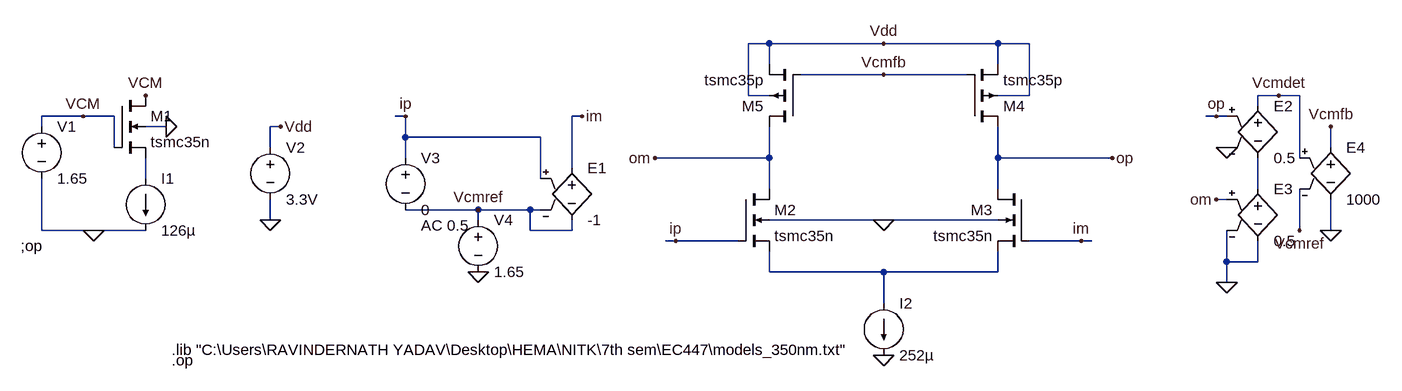
[diagram p0: schematic gm_macro.asc]
gm_macro.asc, the LTspice schematic file:
Version 4
SHEET 1 2024 680
WIRE 1072 -48 1040 -48
WIRE 1248 -48 1072 -48
WIRE 1424 -48 1248 -48
WIRE 1472 -48 1424 -48
WIRE 1072 -16 1072 -48
WIRE 1424 -16 1424 -48
WIRE 1248 0 1120 0
WIRE 1376 0 1248 0
WIRE 1040 32 1040 -48
WIRE 1072 32 1040 32
WIRE 1472 32 1472 -48
WIRE 1472 32 1424 32
WIRE 1856 32 1824 32
WIRE 1888 32 1856 32
WIRE 1824 48 1824 32
WIRE 16 64 -48 64
WIRE 64 64 16 64
WIRE 512 64 496 64
WIRE 784 64 768 64
WIRE 1760 64 1744 64
WIRE 1776 64 1760 64
WIRE -48 80 -48 64
WIRE 144 80 112 80
WIRE 320 80 304 80
WIRE 512 96 512 64
WIRE 720 96 512 96
WIRE 64 112 64 64
WIRE 304 112 304 80
WIRE 1936 112 1936 80
WIRE 512 128 512 96
WIRE 1072 128 1072 80
WIRE 1072 128 896 128
WIRE 1424 128 1424 80
WIRE 1600 128 1424 128
WIRE 1888 128 1888 32
WIRE 768 144 768 64
WIRE 112 160 112 128
WIRE 720 160 720 96
WIRE 1072 176 1072 128
WIRE 1424 176 1424 128
WIRE 1824 176 1824 128
WIRE 1776 192 1760 192
WIRE 624 208 512 208
WIRE 704 208 624 208
WIRE 720 208 704 208
WIRE 304 224 304 192
WIRE 624 224 624 208
WIRE 1248 224 1072 224
WIRE 1424 224 1248 224
WIRE -48 240 -48 160
WIRE 32 240 -48 240
WIRE 112 240 32 240
WIRE 704 240 704 208
WIRE 768 240 768 224
WIRE 768 240 704 240
WIRE 1888 240 1888 176
WIRE 1936 240 1936 192
WIRE 928 256 912 256
WIRE 1024 256 928 256
WIRE 1552 256 1472 256
WIRE 1568 256 1552 256
WIRE 1776 288 1776 240
WIRE 1824 288 1824 256
WIRE 1824 288 1776 288
WIRE 1072 304 1072 272
WIRE 1248 304 1072 304
WIRE 1424 304 1424 272
WIRE 1424 304 1248 304
WIRE 1776 320 1776 288
WIRE 1248 352 1248 304
FLAG 32 240 0
FLAG 144 80 0
FLAG 16 64 VCM
FLAG 112 32 VCM
FLAG 320 80 Vdd
FLAG 304 224 0
FLAG 624 304 0
FLAG 512 64 ip
FLAG 784 64 im
FLAG 624 208 Vcmref
FLAG 1776 112 0
FLAG 1936 240 0
FLAG 1776 320 0
FLAG 1760 64 op
FLAG 1760 192 om
FLAG 1856 32 Vcmdet
FLAG 1888 240 Vcmref
FLAG 1936 80 Vcmfb
FLAG 1248 224 0
FLAG 1248 432 0
FLAG 1600 128 op
FLAG 1552 256 im
FLAG 896 128 om
FLAG 928 256 ip
FLAG 1248 -48 Vdd
FLAG 1248 0 Vcmfb
DATAFLAG 992 128 ""
DATAFLAG 1504 128 ""
DATAFLAG 1504 256 ""
DATAFLAG 992 256 ""
SYMBOL voltage -48 64 R0
SYMATTR InstName V1
SYMATTR Value 1.65
SYMBOL current 112 160 R0
WINDOW 123 0 0 Left 0
WINDOW 39 0 0 Left 0
SYMATTR InstName I1
SYMATTR Value 126µ
SYMBOL nmos4 64 32 R0
SYMATTR InstName M1
SYMATTR Value tsmc35n
SYMATTR Value2 l=0.5u w=1.8u m=8
SYMBOL voltage 304 96 R0
SYMATTR InstName V2
SYMATTR Value 3.3V
SYMBOL voltage 512 112 R0
WINDOW 123 24 120 Left 2
WINDOW 39 0 0 Left 0
SYMATTR Value2 AC 0.5
SYMATTR InstName V3
SYMATTR Value 0
SYMBOL voltage 624 208 R0
WINDOW 123 0 0 Left 0
WINDOW 39 0 0 Left 0
SYMATTR InstName V4
SYMATTR Value 1.65
SYMBOL e 768 128 R0
SYMATTR InstName E1
SYMATTR Value -1
SYMBOL e 1824 32 R0
SYMATTR InstName E2
SYMATTR Value 0.5
SYMBOL e 1824 160 R0
SYMATTR InstName E3
SYMATTR Value 0.5
SYMBOL e 1936 96 R0
SYMATTR InstName E4
SYMATTR Value 1000
SYMBOL nmos4 1024 176 R0
SYMATTR InstName M2
SYMATTR Value tsmc35n
SYMATTR Value2 l=0.5u w=1.8u m=8
SYMBOL nmos4 1472 176 M0
SYMATTR InstName M3
SYMATTR Value tsmc35n
SYMATTR Value2 l=0.5u w=1.8u m=8
SYMBOL pmos4 1376 80 M180
SYMATTR InstName M4
SYMATTR Value tsmc35p
SYMATTR Value2 l=0.5u w=1.8u m=20
SYMBOL pmos4 1120 80 R180
SYMATTR InstName M5
SYMATTR Value tsmc35p
SYMATTR Value2 l=0.5u w=1.8u m=20
SYMBOL current 1248 352 R0
WINDOW 123 0 0 Left 0
WINDOW 39 0 0 Left 0
SYMATTR InstName I2
SYMATTR Value 252µ
TEXT -80 264 Left 2 !;op
TEXT 152 424 Left 2 !.lib "C:\\Users\\RAVINDERNATH YADAV\\Desktop\\HEMA\\NITK\\7th sem\\EC447\\models_350nm.txt"
TEXT 152 440 Left 2 !.op

The netlist it stands for:
* gm_macro.asc
V1 VCM 0 1.65
I1 N001 0 126µ
M1 VCM VCM N001 0 tsmc35n l=0.5u w=1.8u m=8
V2 Vdd 0 3.3V
V3 ip Vcmref 0 AC 0.5
V4 Vcmref 0 1.65
E1 im Vcmref ip Vcmref -1
E2 Vcmdet N002 op 0 0.5
E3 N002 0 om 0 0.5
E4 Vcmfb 0 Vcmdet Vcmref 1000
M2 om ip N003 0 tsmc35n l=0.5u w=1.8u m=8
M3 op im N003 0 tsmc35n l=0.5u w=1.8u m=8
M4 op Vcmfb Vdd Vdd tsmc35p l=0.5u w=1.8u m=20
M5 om Vcmfb Vdd Vdd tsmc35p l=0.5u w=1.8u m=20
I2 N003 0 252µ
.model NMOS NMOS
.model PMOS PMOS
.lib standard.mos
;op
.lib "C:\Users\RAVINDERNATH YADAV\Desktop\HEMA\NITK\7th sem\EC447\models_350nm.txt"
.op
.backanno
.end